# EAGLE design 7006268-0-0 (EAGLE 6.6.0)
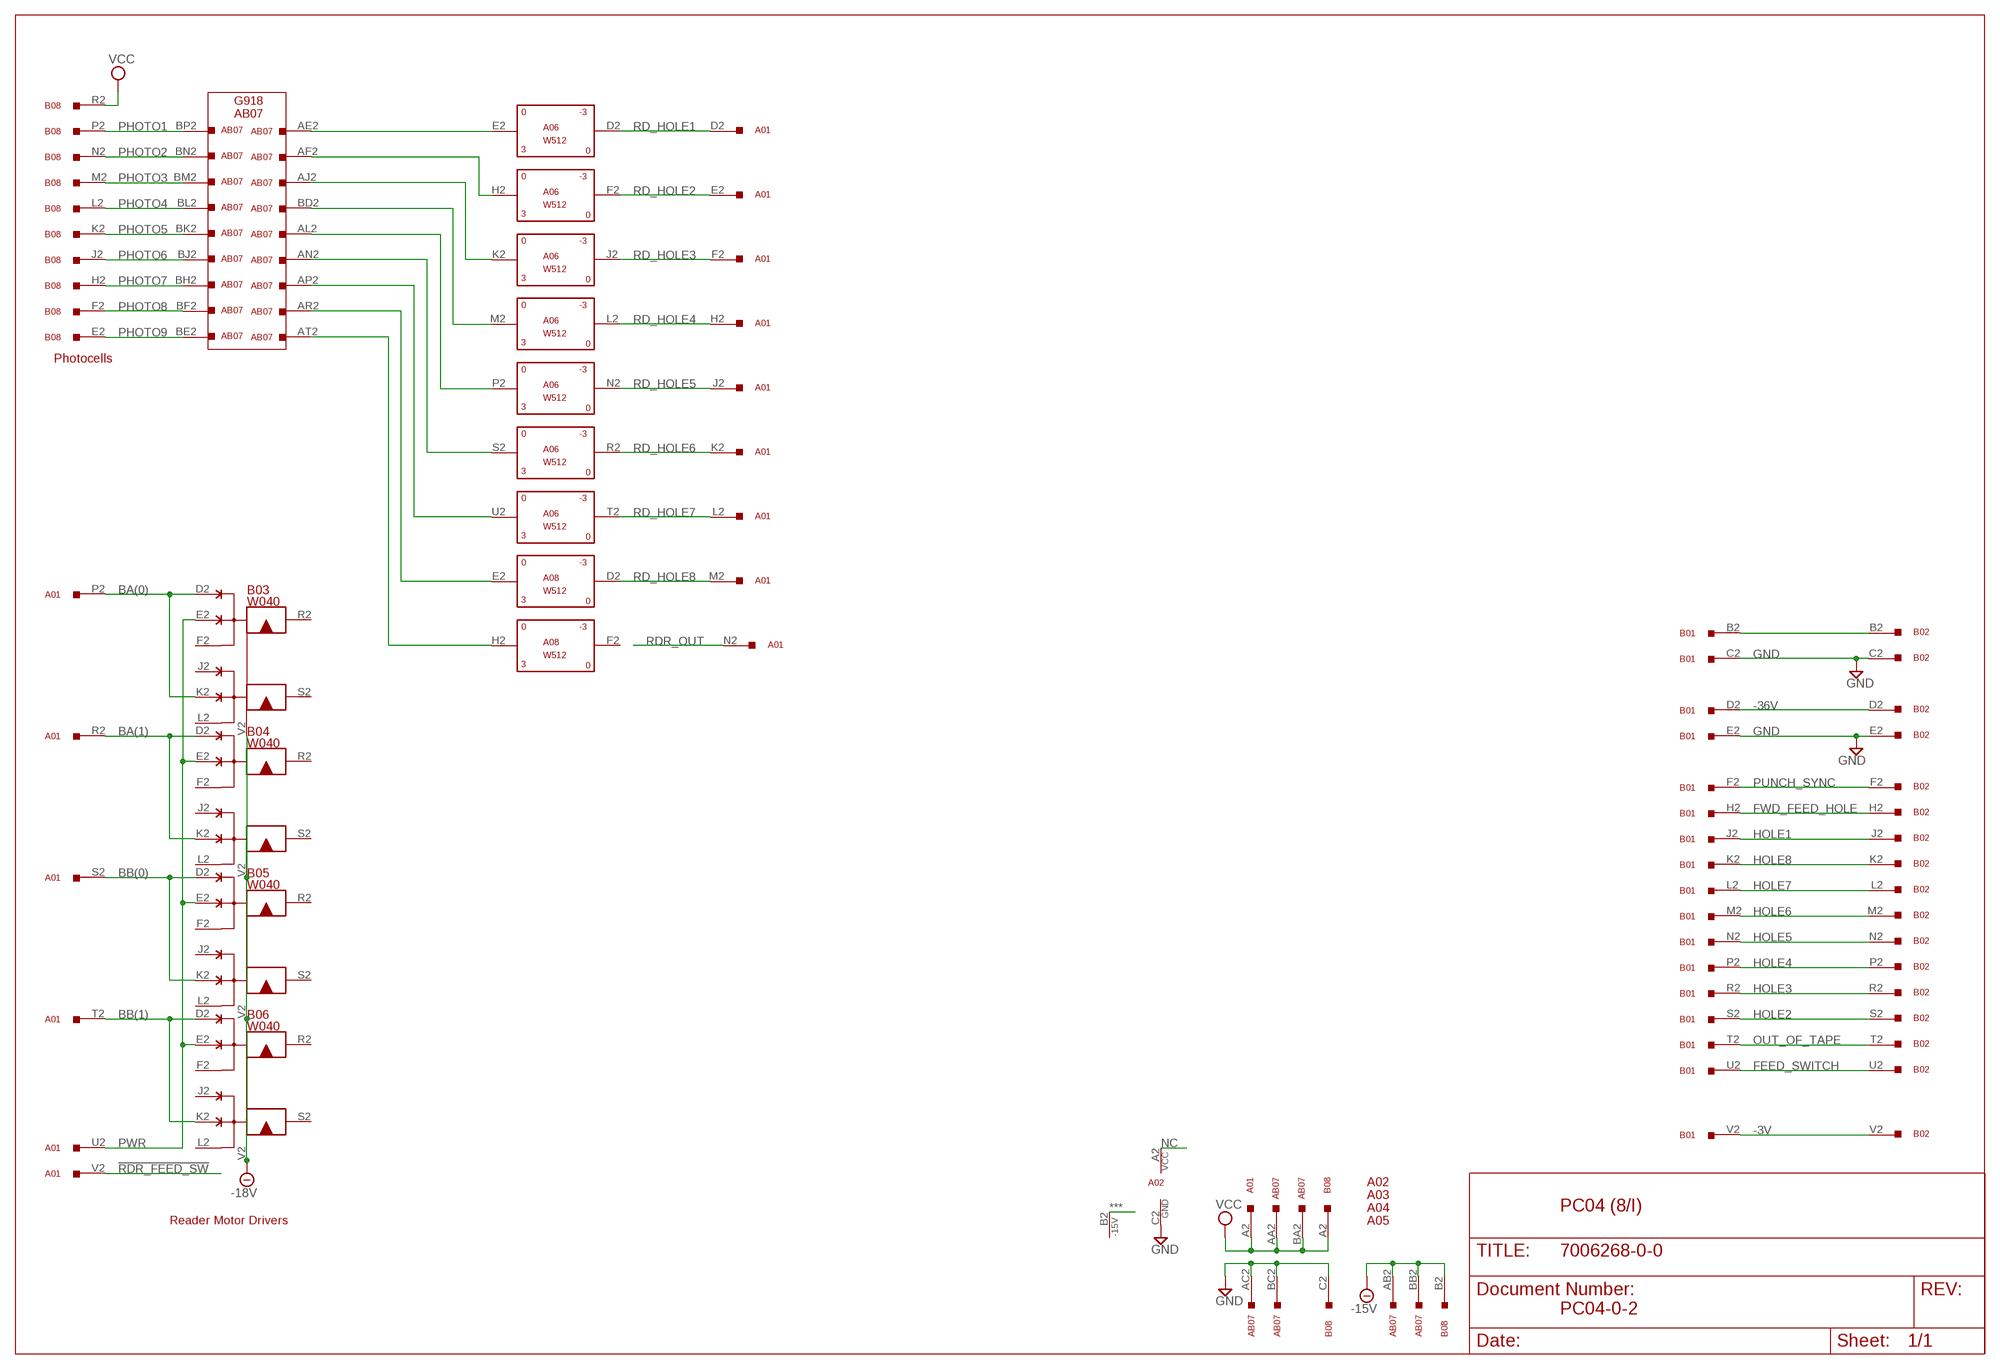
[diagram p0: schematic, sheet 1]

## Parts
A01  W033  W023  [H807]
A02  EMPTY  [H807]
A03  EMPTY  [H807]
A04  EMPTY  [H807]
A05  EMPTY  [H807]
A06  W512  [H807]
A08  W512  [H807]
AB07  G918  W991  [H807-2]
B01  W033  W023  [H807]
B02  W033  W023  [H807]
B03  W040  [H807]
B04  W040  [H807]
B05  W040  [H807]
B06  W040  [H807]
B08  W033  W023  [H807]

## Nets
!RDR_FEED_SW: A01.V2
***: A02.B2
-3V: B01.V2 B02.V2
-15V: AB07.AB2 AB07.BB2 B08.B2
-18V: B03.V2(V) B04.V2(V) B05.V2(V) B06.V2(V)
-36V: B01.D2 B02.D2
BA(0): A01.P2 B03.D2(D) B03.K2(K)
BA(1): A01.R2 B04.D2(D) B04.K2(K)
BB(0): A01.S2 B05.D2(D) B05.K2(K)
BB(1): A01.T2 B06.D2(D) B06.K2(K)
FEED_SWITCH: B01.U2 B02.U2
FWD_FEED_HOLE: B01.H2 B02.H2
GND: A02.C2 AB07.AC2 AB07.BC2 B01.C2 B01.E2 B02.C2 B02.E2 B08.C2
HOLE1: B01.J2 B02.J2
HOLE2: B01.S2 B02.S2
HOLE3: B01.R2 B02.R2
HOLE4: B01.P2 B02.P2
HOLE5: B01.N2 B02.N2
HOLE6: B01.M2 B02.M2
HOLE7: B01.L2 B02.L2
HOLE8: B01.K2 B02.K2
N$1: A06.E2(IN) AB07.AE2
N$2: A06.H2(IN) AB07.AF2
N$3: B01.B2 B02.B2
N$4: A06.K2(IN) AB07.AJ2
N$5: A06.M2(IN) AB07.BD2
N$6: A06.P2(IN) AB07.AL2
N$7: A06.S2(IN) AB07.AN2
N$8: A06.U2(IN) AB07.AP2
N$9: A08.E2(IN) AB07.AR2
N$10: A08.H2(IN) AB07.AT2
NC: A02.A2
OUT_OF_TAPE: B01.T2 B02.T2
PHOTO1: AB07.BP2 B08.P2
PHOTO2: AB07.BN2 B08.N2
PHOTO3: AB07.BM2 B08.M2
PHOTO4: AB07.BL2 B08.L2
PHOTO5: AB07.BK2 B08.K2
PHOTO6: AB07.BJ2 B08.J2
PHOTO7: AB07.BH2 B08.H2
PHOTO8: AB07.BF2 B08.F2
PHOTO9: AB07.BE2 B08.E2
PUNCH_SYNC: B01.F2 B02.F2
PWR: A01.U2 B03.E2(E) B04.E2(E) B05.E2(E) B06.E2(E)
RD_HOLE1: A01.D2 A06.D2(OUT)
RD_HOLE2: A01.E2 A06.F2(OUT)
RD_HOLE3: A01.F2 A06.J2(OUT)
RD_HOLE4: A01.H2 A06.L2(OUT)
RD_HOLE5: A01.J2 A06.N2(OUT)
RD_HOLE6: A01.K2 A06.R2(OUT)
RD_HOLE7: A01.L2 A06.T2(OUT)
RD_HOLE8: A01.M2 A08.D2(OUT)
RDR_OUT: A01.N2
VCC: A01.A2 AB07.AA2 AB07.BA2 B08.A2 B08.R2
Unconnected: A01.B2 A01.C2 A06.V2 A08.F2(OUT) A08.J2(OUT) A08.K2(IN) A08.L2(OUT) A08.M2(IN) A08.N2(OUT) A08.P2(IN) A08.R2(OUT) A08.S2(IN) A08.T2(OUT) A08.U2(IN) A08.V2 AB07.AD2 AB07.AH2 AB07.AK2 AB07.AM2 AB07.AS2 AB07.AU2 AB07.AV2 AB07.BR2 AB07.BS2 AB07.BT2 AB07.BU2 AB07.BV2 B01.A2 B02.A2 B03.F2(F) B03.J2(J) B03.L2(L) B03.R2(R) B03.S2(S) B04.F2(F) B04.J2(J) B04.L2(L) B04.R2(R) B04.S2(S) B05.F2(F) B05.J2(J) B05.L2(L) B05.R2(R) B05.S2(S) B06.F2(F) B06.J2(J) B06.L2(L) B06.R2(R) B06.S2(S) B08.D2 B08.S2 B08.T2 B08.U2 B08.V2

## Notes on the sheet
- G918
- AB07
- Photocells
- PC04 (8/I)
- Reader Motor Drivers
- PC04-0-2

## Power pins joined to a net without a drawn wire
-15V: A03.B2 A04.B2 A05.B2 A06.B2(-15V) A08.B2(-15V) B03.B2(-15V) B04.B2(-15V) B05.B2(-15V) B06.B2(-15V)
GND: A03.C2 A04.C2 A05.C2 A06.C2(GND) A08.C2(GND) B03.C2(GND) B04.C2(GND) B05.C2(GND) B06.C2(GND)
VCC: A03.A2 A04.A2 A05.A2 A06.A2(VCC) A08.A2(VCC) B03.A2(VCC) B04.A2(VCC) B05.A2(VCC) B06.A2(VCC)

## Library data of the parts
A01 B01 B02 B08 = dec-m:W023: One-sided 18 pin connector/cable.
A02-A05 = dec-m:EMPTY: Empty Slot
A06 A08 = dec-m:W512: Positive Level Converter
AB07 = dec-m:W991: One-sided 36 pin (double hight) connector/cable.
B03-B06 = dec-m:W040: Solenoid Driver W040

## Net classes
0 default: width 0.813 mm

## Board
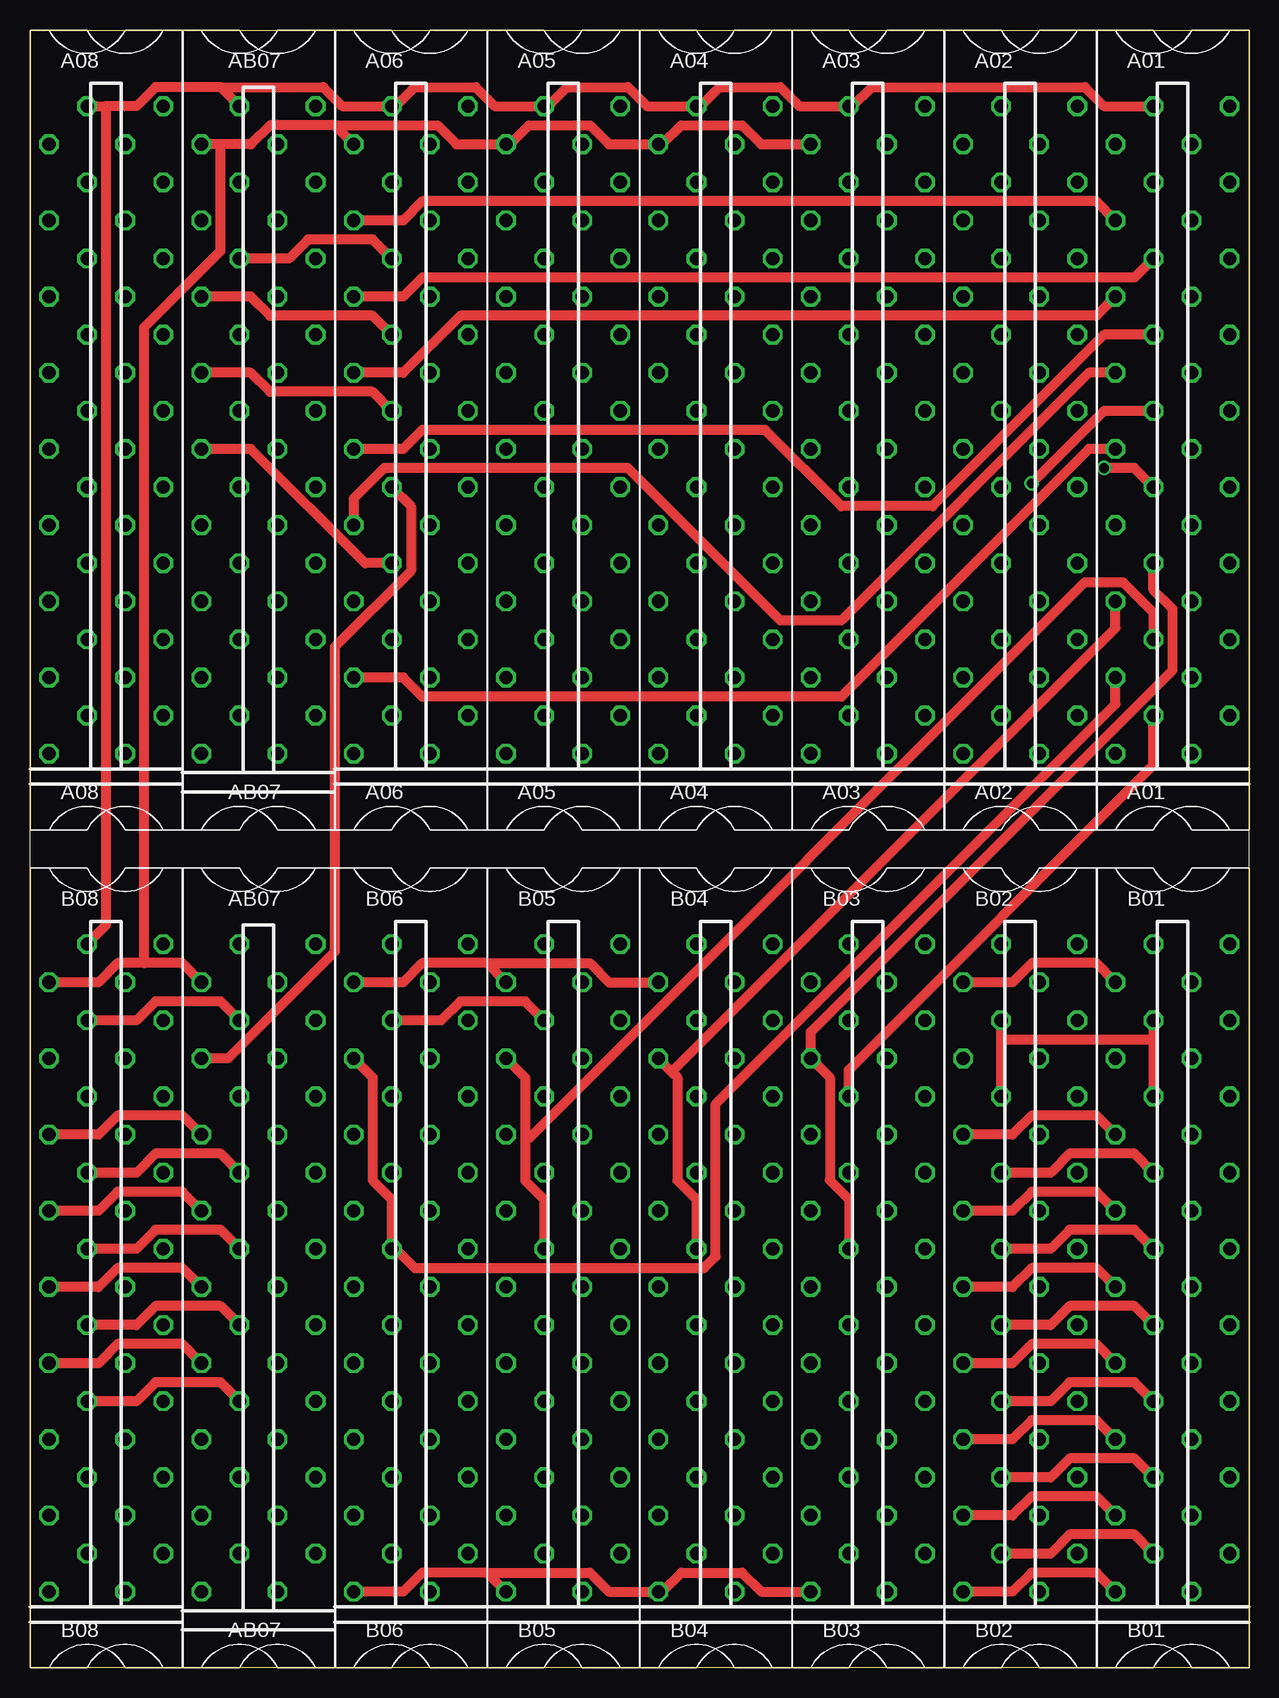
[diagram p1: board, top side]
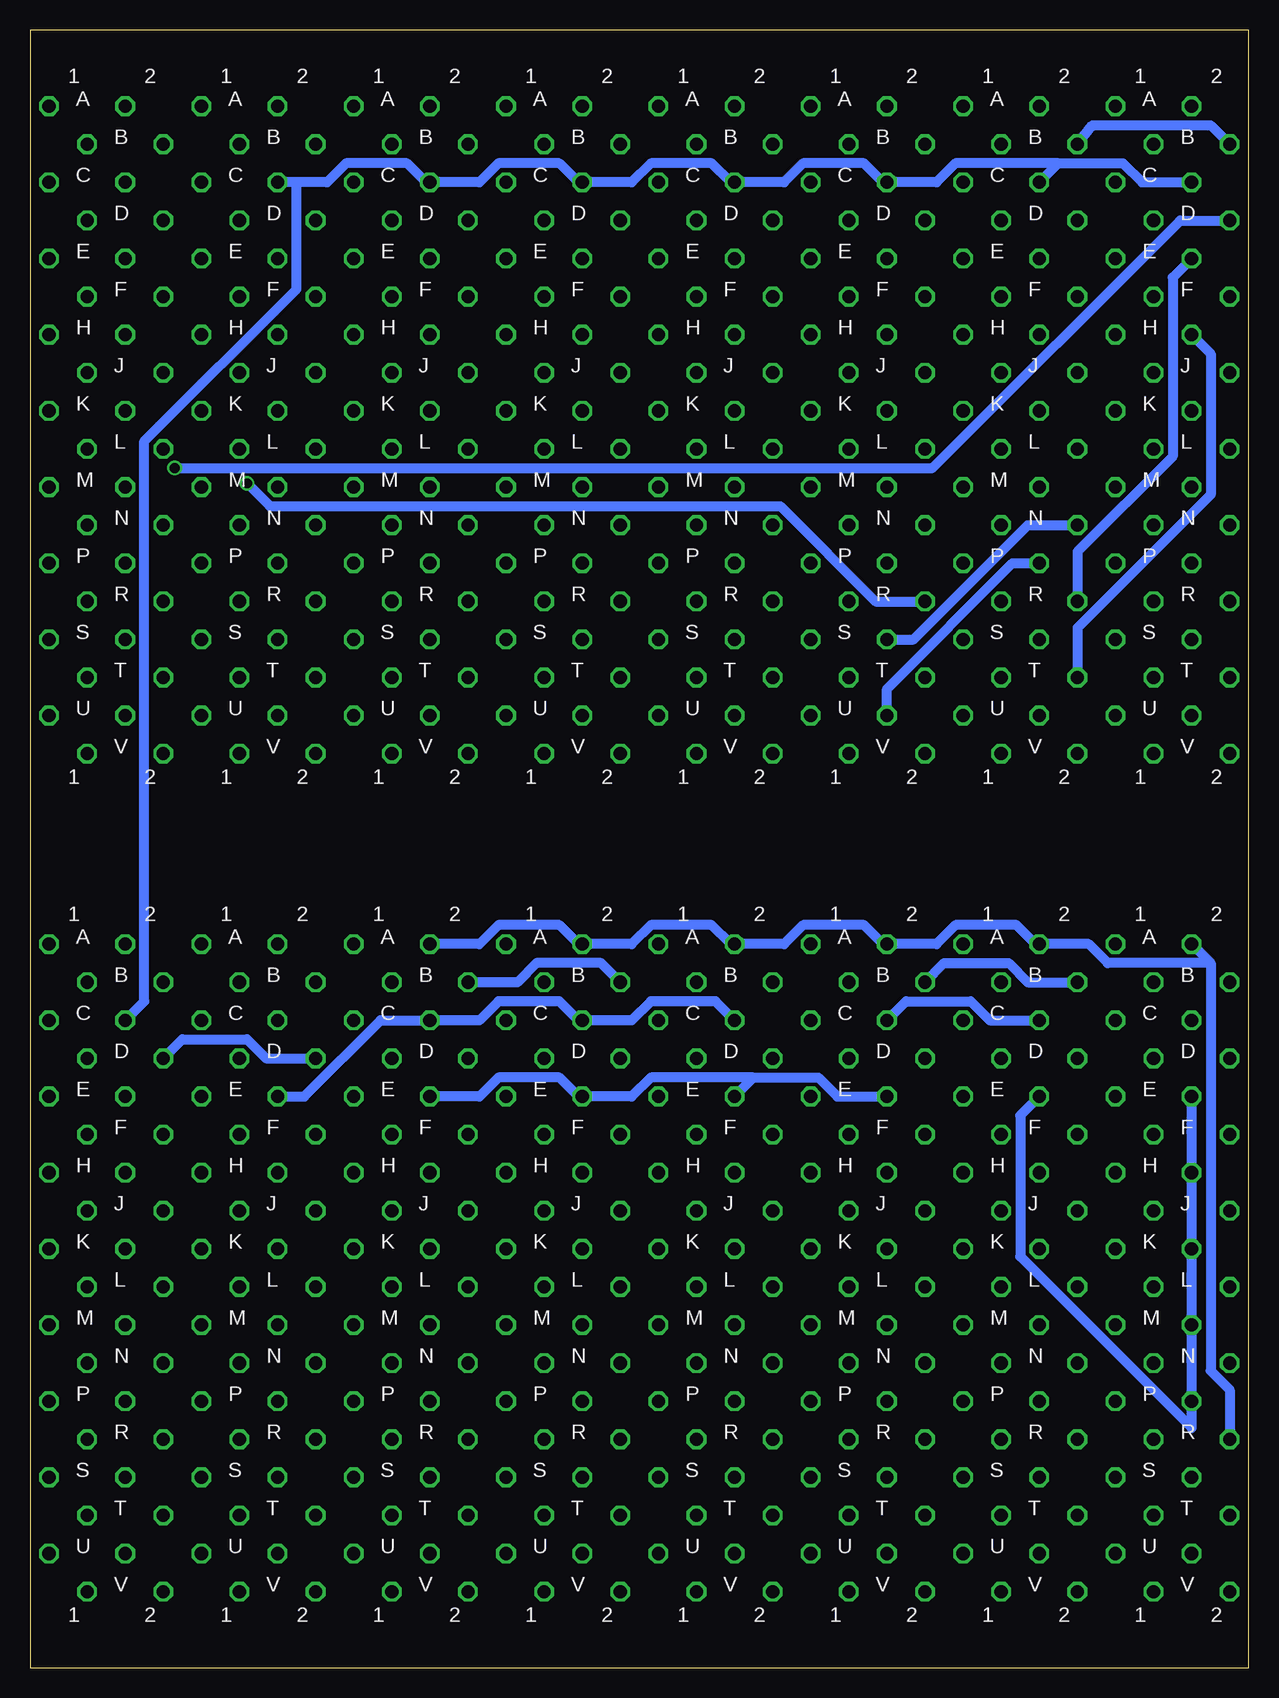
[diagram p2: board, bottom side, seen from below]

Size 101.6 x 136.53 mm. Coordinates in mm from the lower left corner, seen from the top.
Outline: 0,136.53 101.6,136.53 101.6,0 0,0 0,136.53
Copper layers (1+16): Top 0.035mm / dielectric 1.5mm / Bottom 0.035mm
Design rules "16mils": minimum track width 16mil, minimum drill 32mil, track to track 15mil, track to pad 10mil, pad to pad 10mil, via to via 10mil, smd to smd 10mil, copper to edge 13mil, drill to drill 10mil, minimum pad ring 10mil, minimum via ring 8mil, stop-mask expansion 0mil, vias tented up to drill 0mil, thermal gap 10mil

### Footprints (pad centres in the part's own frame; a part is rotated, then mirrored left to right if it is on the bottom)
H807 = drill 1.092 octagon: A1 4.763,28.575; A2 -1.587,28.575; B1 1.587,25.4; B2 -4.763,25.4; C1 4.763,22.225; C2 -1.587,22.225; D1 1.587,19.05; D2 -4.763,19.05; E1 4.763,15.875; E2 -1.587,15.875; F1 1.587,12.7; F2 -4.763,12.7; H1 4.763,9.525; H2 -1.587,9.525; J1 1.587,6.35; J2 -4.763,6.35; K1 4.763,3.175; K2 -1.587,3.175; L1 1.587,0; L2 -4.763,0; M1 4.763,-3.175; M2 -1.587,-3.175; N1 1.587,-6.35; N2 -4.763,-6.35; P1 4.763,-9.525; P2 -1.587,-9.525; R1 1.587,-12.7; R2 -4.763,-12.7; S1 4.763,-15.875; S2 -1.587,-15.875; T1 1.587,-19.05; T2 -4.763,-19.05; U1 4.763,-22.225; U2 -1.587,-22.225; V1 1.587,-25.4; V2 -4.763,-25.4
H807-2 = drill 1.092 octagon: AA1 4.763,60.325; AA2 -1.587,60.325; AB1 1.587,57.15; AB2 -4.763,57.15; AC1 4.763,53.975; AC2 -1.587,53.975; AD1 1.587,50.8; AD2 -4.763,50.8; AE1 4.763,47.625; AE2 -1.587,47.625; AF1 1.587,44.45; AF2 -4.763,44.45; AH1 4.763,41.275; AH2 -1.587,41.275; AJ1 1.587,38.1; AJ2 -4.763,38.1; AK1 4.763,34.925; AK2 -1.587,34.925; AL1 1.587,31.75; AL2 -4.763,31.75; AM1 4.763,28.575; AM2 -1.587,28.575; AN1 1.587,25.4; AN2 -4.763,25.4; AP1 4.763,22.225; AP2 -1.587,22.225; AR1 1.587,19.05; AR2 -4.763,19.05; AS1 4.763,15.875; AS2 -1.587,15.875; AT1 1.587,12.7; AT2 -4.763,12.7; AU1 4.763,9.525; AU2 -1.587,9.525; AV1 1.587,6.35; AV2 -4.763,6.35; BA1 4.763,-9.525; BA2 -1.587,-9.525; BB1 1.587,-12.7; BB2 -4.763,-12.7; BC1 4.763,-15.875; BC2 -1.587,-15.875; BD1 1.587,-19.05; BD2 -4.763,-19.05; BE1 4.763,-22.225; BE2 -1.587,-22.225; BF1 1.587,-25.4; BF2 -4.763,-25.4; BH1 4.763,-28.575; BH2 -1.587,-28.575; BJ1 1.587,-31.75; BJ2 -4.763,-31.75; BK1 4.763,-34.925; BK2 -1.587,-34.925; BL1 1.587,-38.1; BL2 -4.763,-38.1; BM1 4.763,-41.275; BM2 -1.587,-41.275; BN1 1.587,-44.45; BN2 -4.763,-44.45; BP1 4.763,-47.625; BP2 -1.587,-47.625; BR1 1.587,-50.8; BR2 -4.763,-50.8; BS1 4.763,-53.975; BS2 -1.587,-53.975; BT1 1.587,-57.15; BT2 -4.763,-57.15; BU1 4.763,-60.325; BU2 -1.587,-60.325; BV1 1.587,-63.5; BV2 -4.763,-63.5

### Placement (x,y rotation side)
A01  95.25,101.6 0 top
A02  82.55,101.6 0 top
A03  69.85,101.6 0 top
A04  57.15,101.6 0 top
A05  44.45,101.6 0 top
A06  31.75,101.6 0 top
A08  6.35,101.6 0 top
AB07  19.05,69.85 0 top
B01  95.25,31.75 0 top
B02  82.55,31.75 0 top
B03  69.85,31.75 0 top
B04  57.15,31.75 0 top
B05  44.45,31.75 0 top
B06  31.75,31.75 0 top
B08  6.35,31.75 0 top

### Tracks (layer width: path | path; a pad name or v marks a point on that pad's centre or on a via)
-3V
  Top 0.813: B02.V2 81.92,6.35 83.5,7.94 88.9,7.94 B01.V2
-15V
  Top 0.813: 15.88,127 18.41,127 20,128.59 25.4,128.59 | 15.88,127 AB07.AB2 | A06.B2 25.4,128.59 | 25.4,128.59 33.97,128.59 35.56,127 A05.B2 40.01,127 41.59,128.59 46.67,128.59 48.26,127 A04.B2 52.7,127 54.29,128.59 59.37,128.59 60.96,127 A03.B2 | B08.B2 5.71,57.15 7.3,58.74 9.53,58.74 | 9.53,58.74 12.7,58.74 AB07.BB2 | B06.B2 31.11,57.15 32.7,58.74 38.1,58.74 | B05.B2 38.1,58.74 | B04.B2 48.26,57.15 46.67,58.74 38.1,58.74 | 15.88,127 15.88,118.11 9.53,111.76 9.53,58.74
  Bottom 0.813: B03.B2 60.96,57.15 59.37,58.74 53.98,58.74 B04.B2 | AB07.BB2 18.41,57.15 20,58.74 25.4,58.74 B06.B2 | AB07.AB2 13.02,128.59 3.17,128.59 A08.B2
-18V
  Top 0.813: B06.V2 31.11,6.35 32.7,7.94 38.1,7.94 | B05.V2 38.1,7.94 | 38.1,7.94 46.67,7.94 48.26,6.35 B04.V2 52.7,6.35 54.29,7.94 59.37,7.94 60.96,6.35 B03.V2
-36V
  Bottom 0.813: B02.D2 81.92,50.8 83.5,52.39 88.9,52.39 B01.D2
BA(0)
  Top 0.813: B03.K2 68.26,39.05 66.67,40.64 66.67,49.21 B03.D2 65.09,53.02 95.25,83.19 95.25,88.27 93.66,89.85 A01.P2
BA(1)
  Top 0.813: B04.K2 55.56,39.05 53.98,40.64 53.98,49.21 53.5,49.69 | B04.D2 53.5,49.69 | A01.R2 90.49,86.68 53.5,49.69
BB(0)
  Top 0.813: B05.K2 42.86,39.05 41.27,40.64 41.27,44.13 | 41.27,44.13 41.27,49.21 B05.D2 | A01.S2 93.66,87.95 91.12,90.49 87.95,90.49 41.59,44.13 41.27,44.13
BB(1)
  Top 0.813: B06.D2 28.57,49.21 28.57,40.64 30.16,39.05 B06.K2 30.48,34.92 32.07,33.34 56.2,33.34 57.15,34.29 57.15,46.99 90.49,80.33 A01.T2
FEED_SWITCH
  Top 0.813: B02.U2 85.09,9.53 86.68,11.11 92.08,11.11 B01.U2
FWD_FEED_HOLE
  Top 0.813: B02.H2 85.09,41.27 86.68,42.86 92.08,42.86 B01.H2
GND
  Top 0.813: B01.C2 93.66,52.39 | 93.66,52.39 B01.E2 | B02.E2 80.96,52.39 | 80.96,52.39 B02.C2 | 80.96,52.39 93.66,52.39 | B08.C2 8.89,53.98 10.48,55.56 15.88,55.56 AB07.BC2 | B06.C2 34.29,53.98 35.88,55.56 41.27,55.56 B05.C2
  Bottom 0.813: 15.88,125.41 10.48,125.41 8.89,123.83 A08.C2 | AB07.AC2 15.88,125.41 | 15.88,125.41 24.45,125.41 26.04,123.83 A06.C2 30.48,123.83 32.07,125.41 37.15,125.41 38.73,123.83 A05.C2 43.18,123.83 44.77,125.41 49.85,125.41 51.44,123.83 A04.C2 55.88,123.83 57.47,125.41 62.55,125.41 64.14,123.83 A03.C2 68.58,123.83 70.17,125.41 75.25,125.41 76.83,123.83 79.38,123.83 | 79.38,123.83 A02.C2 | B02.E2 78.74,47.62 72.39,53.98 B03.C2 64.14,53.98 62.55,55.56 57.47,55.56 55.88,53.98 B04.C2 51.44,53.98 49.85,55.56 44.45,55.56 B05.C2 | AB07.BC2 21.59,53.98 23.18,55.56 28.57,55.56 B06.C2 | 79.38,123.83 79.38,114.94 92.08,102.23 92.08,55.56 B01.C2
HOLE1
  Top 0.813: B02.J2 81.92,38.1 83.5,39.69 88.9,39.69 B01.J2
HOLE2
  Top 0.813: B02.S2 85.09,15.88 86.68,17.46 92.08,17.46 B01.S2
HOLE3
  Top 0.813: B02.R2 81.92,19.05 83.5,20.64 88.9,20.64 B01.R2
HOLE4
  Top 0.813: B02.P2 85.09,22.23 86.68,23.81 92.08,23.81 B01.P2
HOLE5
  Top 0.813: B02.N2 81.92,25.4 83.5,26.99 88.9,26.99 B01.N2
HOLE6
  Top 0.813: B02.M2 85.09,28.57 86.68,30.16 92.08,30.16 B01.M2
HOLE7
  Top 0.813: B02.L2 81.92,31.75 83.5,33.34 88.9,33.34 B01.L2
HOLE8
  Top 0.813: B02.K2 85.09,34.92 86.68,36.51 92.08,36.51 B01.K2
N$1
  Top 0.813: AB07.AE2 21.59,117.47 23.18,119.06 28.57,119.06 A06.E2
N$2
  Top 0.813: AB07.AF2 18.41,114.3 20,112.71 28.57,112.71 A06.H2
N$3
  Top 0.813: B02.B2 81.92,57.15 83.5,58.74 88.9,58.74 B01.B2
N$4
  Top 0.813: AB07.AJ2 18.41,107.95 20,106.36 28.57,106.36 A06.K2
N$5
  Top 0.813: AB07.BD2 16.51,50.8 25.4,59.69 25.4,85.09 31.75,91.44 31.75,96.84 A06.M2
N$6
  Top 0.813: AB07.AL2 18.41,101.6 27.94,92.08 A06.P2
N$7
  Bottom 0.813: AB07.AN2 18.41,95.25 27.94,85.72 A06.S2
N$8
  Bottom 0.813: AB07.AP2 19.68,92.08 30.16,81.6 A06.U2
N$9
  Bottom 0.813: AB07.AR2 14.29,93.03 6.35,100.97 6.35,115.89 A08.E2
N$10
  Bottom 0.813: AB07.AT2 14.29,86.68 3.17,97.79 3.17,109.54 A08.H2
OUT_OF_TAPE
  Top 0.813: B02.T2 81.92,12.7 83.5,14.29 88.9,14.29 B01.T2
PHOTO1
  Top 0.813: B08.P2 8.89,22.23 10.48,23.81 15.88,23.81 AB07.BP2
PHOTO2
  Top 0.813: B08.N2 5.71,25.4 7.3,26.99 12.7,26.99 AB07.BN2
PHOTO3
  Top 0.813: B08.M2 8.89,28.57 10.48,30.16 15.88,30.16 AB07.BM2
PHOTO4
  Top 0.813: B08.L2 5.71,31.75 7.3,33.34 12.7,33.34 AB07.BL2
PHOTO5
  Top 0.813: B08.K2 8.89,34.92 10.48,36.51 15.88,36.51 AB07.BK2
PHOTO6
  Top 0.813: B08.J2 5.71,38.1 7.3,39.69 12.7,39.69 AB07.BJ2
PHOTO7
  Top 0.813: B08.H2 8.89,41.27 10.48,42.86 15.88,42.86 AB07.BH2
PHOTO8
  Top 0.813: B08.F2 5.71,44.45 7.3,46.04 12.7,46.04 AB07.BF2
PHOTO9
  Bottom 0.813: B08.E2 4.76,20 19.05,34.29 19.05,46.04 AB07.BE2
PUNCH_SYNC
  Top 0.813: B02.F2 81.92,44.45 83.5,46.04 88.9,46.04 B01.F2
PWR
  Top 0.813: A01.U2 93.66,75.25 68.26,49.85 B03.E2
  Bottom 0.813: B06.E2 34.29,47.62 35.88,49.21 41.27,49.21 | B05.E2 41.27,49.21 | 41.27,49.21 49.85,49.21 51.44,47.62 B04.E2 55.88,47.62 57.47,49.21 62.55,49.21 64.14,47.62 B03.E2
RD_HOLE1
  Top 0.813: A06.D2 31.11,120.65 32.7,122.24 88.9,122.24 A01.D2
RD_HOLE2
  Top 0.813: A06.F2 31.11,114.3 32.7,115.89 92.08,115.89 A01.E2
RD_HOLE3
  Top 0.813: A06.J2 31.11,107.95 35.88,112.71 88.9,112.71 A01.F2
RD_HOLE4
  Top 0.813: A06.L2 31.11,101.6 32.7,103.19 61.28,103.19 67.63,96.84 75.25,96.84 89.53,111.12 A01.H2
RD_HOLE5
  Top 0.813: A06.N2 26.99,97.47 29.53,100.01 49.85,100.01 62.55,87.31 67.63,87.31 88.27,107.95 A01.J2
RD_HOLE6  (via drill 0.81)
  Top 0.813: v83.5,98.74 89.53,104.78 A01.K2
  Bottom 0.813: A06.R2 31.11,88.9 39.05,96.84 81.6,96.84 v83.5,98.74
RD_HOLE7
  Top 0.813: A06.T2 31.11,82.55 32.7,80.96 67.63,80.96 88.27,101.6 A01.L2
RD_HOLE8  (via drill 0.81)
  Top 0.813: v89.53,100.01 92.08,100.01 A01.M2
  Bottom 0.813: A08.D2 5.71,120.65 26.35,100.01 v89.53,100.01
VCC
  Top 0.813: 6.35,130.18 8.89,130.18 10.48,131.76 15.88,131.76 | AB07.AA2 15.88,131.76 | 15.88,131.76 24.45,131.76 26.04,130.18 A06.A2 30.48,130.18 32.07,131.76 37.15,131.76 38.73,130.18 A05.A2 43.18,130.18 44.77,131.76 49.85,131.76 51.44,130.18 A04.A2 55.88,130.18 57.47,131.76 62.55,131.76 64.14,130.18 A03.A2 68.58,130.18 70.17,131.76 87.95,131.76 89.53,130.18 A01.A2 | 6.35,130.18 6.35,61.91 B08.A2 | A08.A2 6.35,130.18
  Bottom 0.813: B08.R2 1.59,23.18 3.17,24.77 3.17,58.74 | B08.A2 3.17,58.74 | 3.17,58.74 11.75,58.74 13.34,60.33 AB07.BA2 17.78,60.33 19.37,61.91 24.45,61.91 26.04,60.33 B06.A2 30.48,60.33 32.07,61.91 37.15,61.91 38.73,60.33 B05.A2 43.18,60.33 44.77,61.91 49.85,61.91 51.44,60.33 B04.A2 55.88,60.33 57.47,61.91 62.55,61.91 64.14,60.33 B03.A2